# Altium project FEV-60_12V_Module.PrjPcb
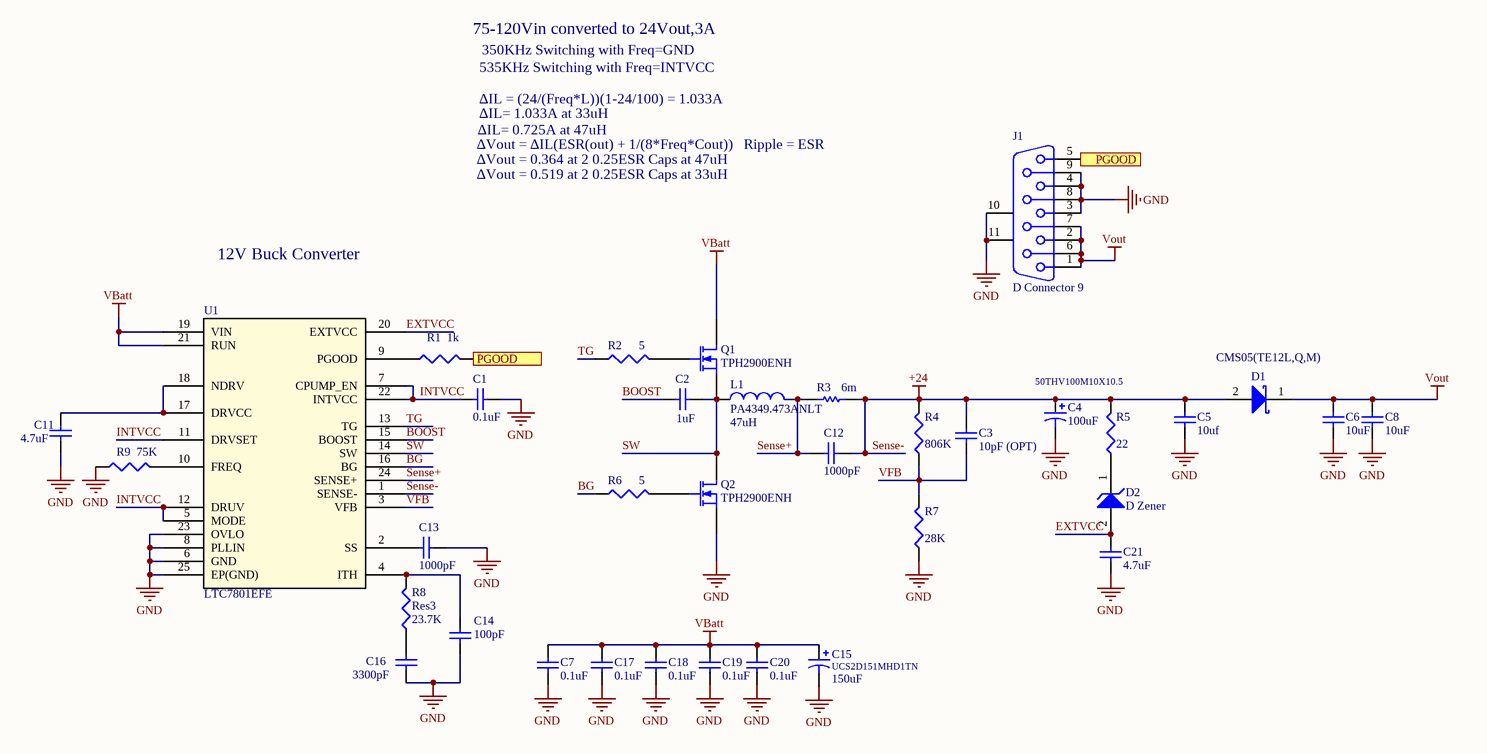
[diagram p0: FEV-60_12V_Module.SchDoc]
Rev: A0
1 sheet, 35 parts. Net scope: flat (ports and power ports of the same name join across sheets).
Board file: FEV-60_12V_Module.PcbDoc

## Sheet FEV-60_12V_Module.SchDoc
size B

### Parts
C1  value 0.1uF  [1608[0603]]  (hidden comment: Cap Semi)
C2  value 1uF  [1608[0603]]  (hidden comment: Cap Semi)
C3  value 10pF (OPT)  [1608[0603]]  (hidden comment: Cap Semi)
C4  50THV100M10X10.5  value 100uF  [CAP_J-V_10X10P5]
C5  value 10uf  [C1206]  (hidden comment: Cap Semi)
C6  value 10uF  [C1206]  (hidden comment: Cap Semi)
C7  value 0.1uF  [C1206]  (hidden comment: Cap Semi)
C8  value 10uF  [C1206]  (hidden comment: Cap Semi)
C11  value 4.7uF  [1608[0603]]  (hidden comment: Cap Semi)
C12  value 1000pF  [1608[0603]]  (hidden comment: Cap Semi)
C13  value 1000pF  [1608[0603]]  (hidden comment: Cap Semi)
C14  value 100pF  [1608[0603]]  (hidden comment: Cap Semi)
C15  UCS2D151MHD1TN  value 150uF  [UCS2D151MHD1TN]
C16  value 3300pF  [1608[0603]]  (hidden comment: Cap Semi)
C17  value 0.1uF  [C1206]  (hidden comment: Cap Semi)
C18  value 0.1uF  [C1206]  (hidden comment: Cap Semi)
C19  value 0.1uF  [C1206]  (hidden comment: Cap Semi)
C20  value 0.1uF  [C1206]  (hidden comment: Cap Semi)
C21  value 4.7uF  [1608[0603]]  (hidden comment: Cap Semi)
D1  CMS05(TE12L,Q,M)  [CMS05(TE12L,Q,M)]
D2  D Zener  [SMA]
J1  D Connector 9  [DSUB1.385-2H9]
L1  PA4349.473ANLT  value 47uH  [PA4349.473ANLT]
Q1  TPH2900ENH  [TPH2900ENH]
Q2  TPH2900ENH  [TPH2900ENH]
R1  value 1k  [J1-0603]  (hidden comment: Res3)
R2  value 5  [J1-0603]  (hidden comment: Res3)
R3  6m  [RESC2512(6432)_L]
R4  value 806K  [J1-0603]  (hidden comment: Res3)
R5  value 22  [J1-0603]  (hidden comment: Res3)
R6  value 5  [J1-0603]  (hidden comment: Res3)
R7  value 28K  [J1-0603]  (hidden comment: Res3)
R8  Res3  value 23.7K  [J1-0603]
R9  value 75K  [J1-0603]  (hidden comment: Res3)
U1  LTC7801EFE  [LTC7801]

### Ports
PGOOD (out)

### Nets
GND: C1.1 C4.2 C5.1 C6.1 C7.1 C8.1 C11.1 C13.1 C14.1 C15.2 C16.1 C17.1 C18.1 C19.1 C20.1 C21.1 J1.3 J1.4 J1.8 J1.9 J1.10(MH1) J1.11(MH2) Q2.3(S) R7.1 R9.1 U1.6(GND) U1.8(PLLIN) U1.23(OVLO) U1.25(EP(GND))
Sense-: C3.2 C4.1 C5.2 C12.1 D1.2(A) R3.2 R4.2 R5.2 U1.1(SENSE-)  [also labelled +24]
VBatt: C7.2 C15.1 C17.2 C18.2 C19.2 C20.2 Q1.1(D) U1.19(VIN) U1.21(RUN)
Vout: C6.2 C8.2 D1.1(K) J1.1 J1.2 J1.6 J1.7
BG: R6.1 U1.16(BG)
BOOST: C2.2 U1.15(BOOST)
EXTVCC: C21.2 D2.2(A) U1.20(EXTVCC)
INTVCC: C1.2 U1.5(MODE) U1.7(CPUMP_EN) U1.11(DRVSET) U1.12(DRUV) U1.22(INTVCC)
Sense+: C12.2 L1.2 R3.1 U1.24(SENSE+)
SW: C2.1 L1.1 Q1.3(S) Q2.1(D) U1.14(SW)
TG: R2.1 U1.13(TG)
VFB: C3.1 R4.1 R7.2 U1.3(VFB)
NetC11_2: C11.2 U1.17(DRVCC) U1.18(NDRV)
NetC13_2: C13.2 U1.2(SS)
NetC14_2: C14.2 R8.2 U1.4(ITH)
NetC16_2: C16.2 R8.1
NetD2_1: D2.1(K) R5.1
NetJ1_5: J1.5 R1.2 ; port PGOOD
NetQ1_2: Q1.2(G) R2.2
NetQ2_2: Q2.2(G) R6.2
NetR1_1: R1.1 U1.9(PGOOD)
NetR9_2: R9.2 U1.10(FREQ)

### Notes on the sheet
- 75-120Vin converted to 24Vout,3A
- 535KHz Switching with Freq=INTVCC
- ∆IL = (24/(Freq*L))(1-24/100) = 1.033A
- 350KHz Switching with Freq=GND
- ∆Vout = ∆IL(ESR(out) + 1/(8*Freq*Cout))   Ripple = ESR
- ∆Vout = 0.364 at 2 0.25ESR Caps at 47uH
- ∆Vout = 0.519 at 2 0.25ESR Caps at 33uH
- ∆IL= 0.725A at 47uH
- ∆IL= 1.033A at 33uH
- 12V Buck Converter
- Title
- Date:
- Revision:
- Number:
- Team Skytanic
- Sheet
- of
- Senior Design
- 2019/2020
- File:

### Library data of the parts
C1-C3 C5-C8 C11-C14 C16-C21 = Cap Semi: Capacitor (Semiconductor SIM Model); Published: 8-Jun-2000; LatestRevisionDate: 29-May-2009; LatestRevisionNote: IPC-7351 Footprint Added.; PackageReference: C1206; Publisher: Altium Limited; PackageDescription: Chip Capacitor
C4 C15 = Cap Pol3: Polarized Capacitor (Surface Mount); Published: 8-Jun-2000; LatestRevisionDate: 29-May-2009; LatestRevisionNote: IPC-7351 Footprint Added.; PackageReference: C0805; Publisher: Altium Limited; PackageDescription: Chip Capacitor; ComponentLink1Description: Digikey
  C4: ComponentLink1URL: https://www.digikey.com/product-detail/en/nichicon/UVY1V101MED1TD/493-12937-1-ND/4328554
  C15: ComponentLink1URL: https://www.digikey.com/product-detail/en/nichicon/UCY2C151MHD9TO/493-13302-1-ND/4333061
D1 = Diode 10TQ035: Schottky Rectifier; Manufacturer: Toshiba; Note: Terminal 2 is the TAB and is electrically connected to the cathode; Published: 8-Jun-2000; LatestRevisionDate: 17-Jul-2002; LatestRevisionNote: Re-released for DXP Platform.; DatasheetVersion: PD-2.057B; PackageVersion: Feb-1998; PackageReference: TO-220AC; Publisher: Altium Limited; PackageDescription: TO, Thru-Hole, Vertical, Heatsink Mounted; 3 In-Line Leads (1 Absent); Pitch 2.54 mm; ComponentLink1Description: Manufacturer Link; ComponentLink1URL: http://www.irf.com/; ComponentLink2Description: Datasheet; ComponentLink2URL: http://www.irf.com/product-info/datasheets/data/10tq.pdf; Part Number: CMS05(TE12L,Q,M)
D2 = D Zener: Zener Diode; Published: 8-Jun-2000; LatestRevisionDate: 17-Jul-2002; LatestRevisionNote: Re-released for DXP Platform.; PackageReference: DIODE-0.7; Publisher: Altium Limited; PackageDescription: Diode, Thru-Hole; 2 Leads; 0.7 in Pin Spacing
J1 = D Connector 9: Receptacle Assembly, 9 Position, Right Angle; PackageDocument: O; Positions: 9; Published: 15-Jun-2001; LatestRevisionDate: 17-Jul-2002; LatestRevisionNote: Re-released for DXP Platform.; DatasheetDocument: 1-Sep-1999; PackageReference: 788750; Publisher: Altium Limited; Orientation: Right Angle; Gender: Receptacle
L1 = Inductor: Code_IEC: 1005; Published: 8-Jun-2000; LatestRevisionDate: 29-May-2009; LatestRevisionNote: IPC-7351 Footprint Added.; PackageReference: 0402-A; Publisher: Altium Limited; PackageDescription: Chip Inductor; Code_JEITA: 0402
Q1 Q2 = TPH2900ENH: N-Channel 200V 33A (Ta) 78W (Tc) Surface Mount 8-SOP Advance (5x5); Manufacturer: Toshiba; Part Number: TPH2900ENHL1QCT-ND; ComponentLink1Description: TPH2900ENH; ComponentLink1URL: https://www.digikey.com/product-detail/en/toshiba-semiconductor-and-storage/TPH2900ENHL1Q/TPH2900ENHL1QCT-ND/5456291
R1 R2 R4-R9 = Res3: Resistor; Published: 8-Jun-2000; LatestRevisionDate: 29-May-2009; LatestRevisionNote: IPC-7351 Footprint Added.; PackageReference: J1-0603; Publisher: Altium Limited; PackageDescription: Chip Resistor
R3 = CMP-1018-00006-1: 2512; Manufacturer: Rohm Semiconductor; Part Number: PMR100HZPFU6L00; Tolerance: 5 %; Case-Metric: 6432; Value: 1.50 Ohm; Power: 1 W; Technology: SMT; Case-EIA: 2512
U1 = LTC7801EFE: Buck Regulator Positive Output Step-Down DC-DC Controller IC 24-TSSOP; Manufacturer: Analog Devices; Part Number: LTC7801EFE#PBF; Copyright: Copyright (C) 2018 Accelerated Designs. All rights reserved; RefDes: RefDes; Type: DEV; Value: Value